# Altium schematic sheet CAN.SchDoc
size A; SheetNumber: 3; SheetTotal: 10
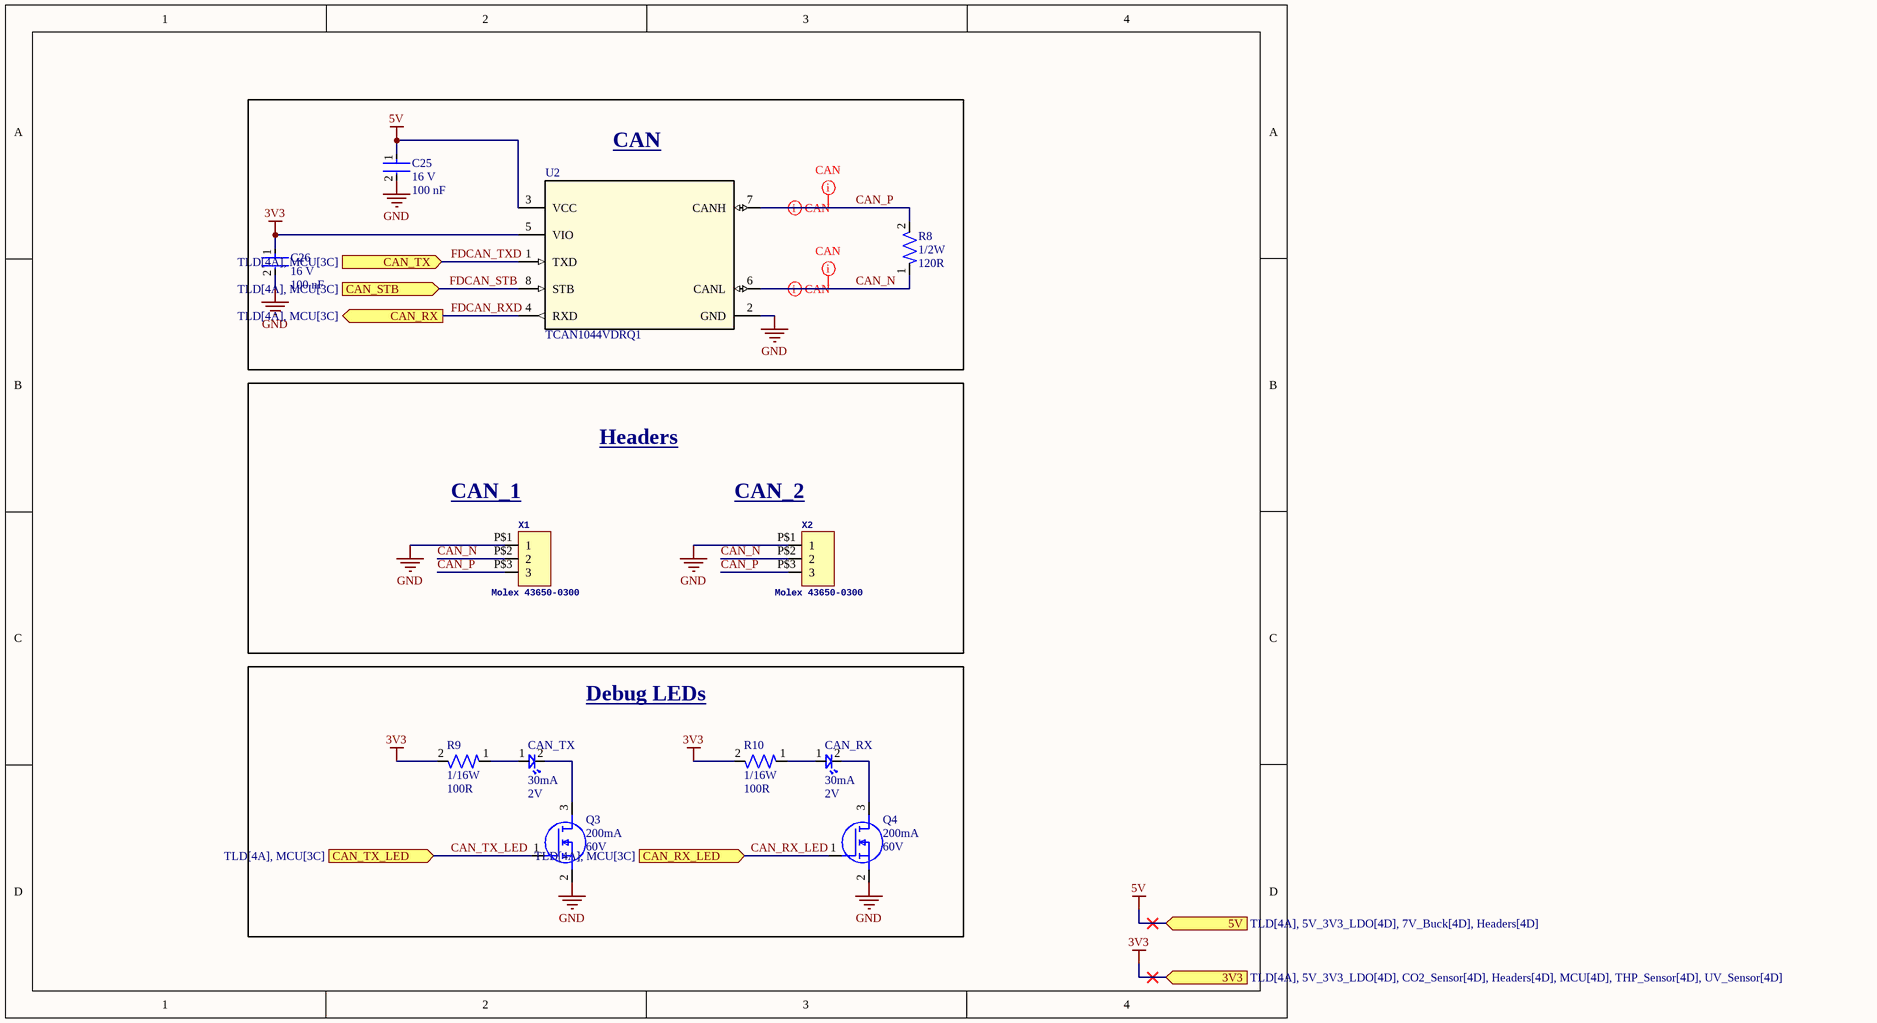
[diagram p0: CAN.SchDoc]

## Parts
C25  Voltage Rating: 16 V  Capacitance: 100 nF  [CAP-0402]  (hidden comment: CC0402KRX7R7BB104)
C26  Voltage Rating: 16 V  Capacitance: 100 nF  [CAP-0402]  (hidden comment: CC0402KRX7R7BB104)
CAN_RX  Forward Current: 30mA  Forward Voltage: 2V  [LED-0603]  (hidden comment: BL-HKC36G-AV-TRB)
CAN_TX  Forward Current: 30mA  Forward Voltage: 2V  [LED-0603]  (hidden comment: BL-HKC36G-AV-TRB)
Q3  Continuous Current: 200mA  Voltage: 60V  [IC-SOT23-3]  (hidden comment: T2N7002AK,LM)
Q4  Continuous Current: 200mA  Voltage: 60V  [IC-SOT23-3]  (hidden comment: T2N7002AK,LM)
R8  Power: 1/2W  Resistance: 120R  [RES-1210]  (hidden comment: RC1210FR-07120RL)
R9  Power: 1/16W  Resistance: 100R  [RES-0402]  (hidden comment: RC0402FR-07100RL)
R10  Power: 1/16W  Resistance: 100R  [RES-0402]  (hidden comment: RC0402FR-07100RL)
U2  TCAN1044VDRQ1  [IC-8SOIC]
X1  Molex 43650-0300  [43650-0300]
X2  Molex 43650-0300  [43650-0300]

## Blocks framed on the sheet
CAN: C25 C26 R8 U2
Debug LEDs: CAN_RX CAN_TX Q3 Q4 R9 R10

## Ports
3V3 (in, see TLD[4A], 5V_3V3_LDO[4D], CO2_Sensor[4D], Headers[4D], MCU[4D], THP_Sensor[4D], UV_Sensor[4D]), 5V (in, see TLD[4A], 5V_3V3_LDO[4D], 7V_Buck[4D], Headers[4D]), CAN_RX (out, see TLD[4A], MCU[3C]), CAN_RX_LED (in, see TLD[4A], MCU[3C]), CAN_STB (in, see TLD[4A], MCU[3C]), CAN_TX (in, see TLD[4A], MCU[3C]), CAN_TX_LED (in, see TLD[4A], MCU[3C])

## Nets
3V3: C26.1 R9.2 R10.2 U2.5(VIO) ; port 3V3
5V: C25.1 U2.3(VCC) ; port 5V
GND: C25.2 C26.2 Q3.2(S) Q4.2(S) U2.2(GND) X1.P$1(1) X2.P$1(1)
CAN_N: R8.1 U2.6(CANL) X1.P$2(2) X2.P$2(2)
CAN_P: R8.2 U2.7(CANH) X1.P$3(3) X2.P$3(3)
CAN_RX_LED: Q4.1(G) ; port CAN_RX_LED
CAN_TX_LED: Q3.1(G) ; port CAN_TX_LED
FDCAN_RXD: U2.4(RXD) ; port CAN_RX
FDCAN_STB: U2.8(STB) ; port CAN_STB
FDCAN_TXD: U2.1(TXD) ; port CAN_TX
NetCAN_RX_1: CAN_RX.1 R10.1
NetCAN_RX_2: CAN_RX.2 Q4.3(D)
NetCAN_TX_1: CAN_TX.1 R9.1
NetCAN_TX_2: CAN_TX.2 Q3.3(D)

## Layout directives
differential pair; differential pair class CAN: CAN_N, CAN_P
net class CAN: CAN_N, CAN_P

## Notes on the sheet
- (near X1) CAN_1
- Headers
- (near X2) CAN_2

## Library data of the parts
C25 C26 = CAP-0.1U-0001: CAP CER 0.1UF 16V X7R 0402; ComponentLink2Description: Datasheet; ComponentLink2URL: https://www.yageo.com/upload/media/product/productsearch/datasheet/mlcc/UPY-GPHC_X7R_6.3V-to-250V_24.pdf; Device Class: Ceramic; Size: 0402
CAN_RX CAN_TX = LED-0001: LED YELLOW CLEAR 0603 SMD; ComponentLink1Description: Datasheet; ComponentLink1URL: https://www.americanbrightled.com/pdffiles/led-components/smt/BL-HKC36G-AV-TRB.pdf
Q3 Q4 = NMOS-200MA-0001: MOSFET N-CH 60V 200MA SOT23; ComponentLink1Description: Datasheet; ComponentLink1URL: https://toshiba.semicon-storage.com/info/T2N7002AK_datasheet_en_20150401.pdf?did=29712&prodName=T2N7002AK
R8 = RES-120-0001: RES 120 OHM 1% 1/2W 1210; Tolerance: 1%; Size: 1210; ComponentLink1Description: Datasheet; ComponentLink1URL: https://www.yageo.com/upload/media/product/products/datasheet/rchip/PYu-RC_Group_51_RoHS_L_12.pdf
R9 R10 = RES-100-0001: RES 100 OHM 1% 1/16W 0402; Tolerance: 1%; Size: 0402; ComponentLink1Description: Datasheet; ComponentLink1URL: https://www.yageo.com/upload/media/product/products/datasheet/rchip/PYu-RC_Group_51_RoHS_L_12.pdf
U2 = IC-CAN-0001: IC TRANSCEIVER 1/1 8SOIC; ComponentLink1Description: Datasheet; ComponentLink1URL: https://www.ti.com/lit/ds/symlink/tcan1044-q1.pdf?HQS=dis-dk-null-digikeymode-dsf-pf-null-wwe&ts=1728758303289&ref_url=https%253A%252F%252Fwww.ti.com%252Fgeneral%252Fdocs%252Fsuppproductinfo.tsp%253FdistId%253D10%2526gotoUrl%253Dhttps%253A%252F%252Fwww.ti.com%252Flit%252Fgpn%252Ftcan1044-q1
X1 X2 = Micro-Fit Molex 3 Pin Right Angle: GateName_1: G$1; SymbolName_1: HEADER_POS3; DeviceSetName: HEADER_POS3_?; DeviceName: 43650-0300; LibraryName: con-molex-micro-fit-3_0_2; Package: 43650-0300